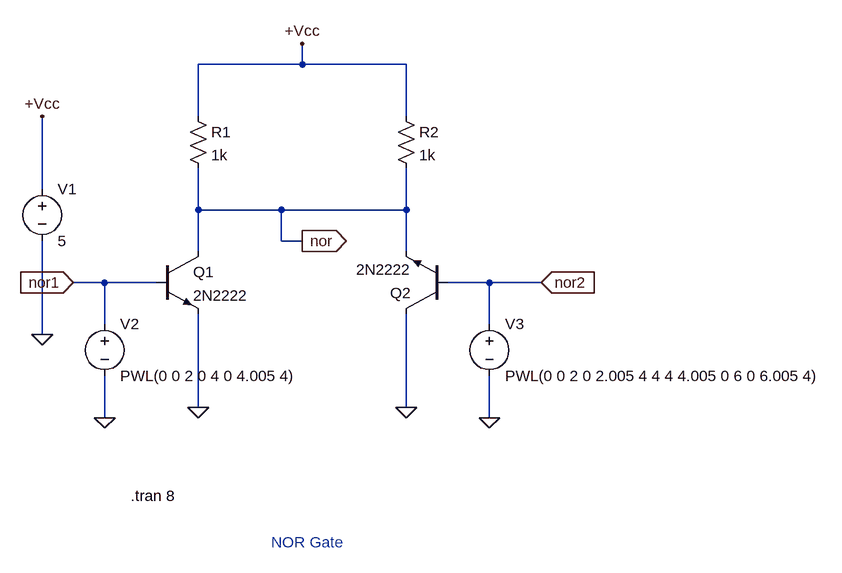
[diagram p0: schematic NOR gate.asc]
NOR gate.asc, the LTspice schematic file:
Version 4
SHEET 1 1284 680
WIRE 448 -112 448 -144
WIRE 448 -112 288 -112
WIRE 608 -112 448 -112
WIRE 288 -32 288 -112
WIRE 608 -32 608 -112
WIRE 48 80 48 -32
WIRE 288 112 288 48
WIRE 416 112 288 112
WIRE 608 112 608 48
WIRE 608 112 416 112
WIRE 416 160 416 112
WIRE 448 160 416 160
WIRE 288 176 288 112
WIRE 608 176 608 112
WIRE 144 224 96 224
WIRE 224 224 144 224
WIRE 736 224 672 224
WIRE 816 224 736 224
WIRE 144 288 144 224
WIRE 736 288 736 224
WIRE 48 304 48 160
WIRE 288 416 288 272
WIRE 608 416 608 272
WIRE 144 432 144 368
WIRE 736 432 736 368
FLAG 48 304 0
FLAG 288 416 0
FLAG 608 416 0
FLAG 48 -32 +Vcc
FLAG 448 -144 +Vcc
FLAG 144 432 0
FLAG 736 432 0
FLAG 96 224 nor1
IOPIN 96 224 In
FLAG 816 224 nor2
IOPIN 816 224 In
FLAG 448 160 nor
IOPIN 448 160 Out
SYMBOL voltage 48 64 R0
SYMATTR InstName V1
SYMATTR Value 5
SYMBOL res 272 -48 R0
SYMATTR InstName R1
SYMATTR Value 1k
SYMBOL res 592 -48 R0
SYMATTR InstName R2
SYMATTR Value 1k
SYMBOL npn 224 176 R0
SYMATTR InstName Q1
SYMATTR Value 2N2222
SYMBOL npn 672 272 R180
SYMATTR InstName Q2
SYMATTR Value 2N2222
SYMBOL voltage 144 272 R0
WINDOW 123 0 0 Left 0
WINDOW 39 0 0 Left 0
SYMATTR InstName V2
SYMATTR Value PWL(0 0 2 0 4 0 4.005 4)
SYMBOL voltage 736 272 R0
WINDOW 123 0 0 Left 0
WINDOW 39 0 0 Left 0
SYMATTR InstName V3
SYMATTR Value PWL(0 0 2 0 2.005 4 4 4 4.005 0 6 0 6.005 4)
TEXT 184 552 Left 2 !.tran 8
TEXT 400 624 Left 2 ;NOR Gate

The netlist it stands for:
* NOR gate.asc
V1 +Vcc 0 5
R1 +Vcc nor 1k
R2 +Vcc nor 1k
Q1 nor nor1 0 0 2N2222
Q2 0 nor2 nor 0 2N2222
V2 nor1 0 PWL(0 0 2 0 4 0 4.005 4)
V3 nor2 0 PWL(0 0 2 0 2.005 4 4 4 4.005 0 6 0 6.005 4)
.model NPN NPN
.model PNP PNP
.lib standard.bjt
.tran 8
* NOR Gate
.backanno
.end